# Altium project SC944D.PrjPCB (part 2 of 4)

## Sheet SDEC944-xD_Chargeur_Batterie.SchDoc: Chargeur Batterie
size 393 x 270 mm; CompanyName: Seccom; Address1: 521, rue du capt. François Garbit; Address2: 69440 Mornant; Address3: seccom@seccom.fr; Address4: www.seccom.fr; DocumentNumber: 4; SheetNumber: 4; SheetTotal: 22; PageSetup: Record=PageOptions|CenterHorizontal=True|CenterVertical=True|PrintScale=0.72|XCorrection=1.00|YCorrection=1.00|PrintKind=0|BorderSize=5000000|LeftOffset=0|BottomOffset=0|Orientation=2|PaperLength=1000|PaperWidth=1000|Scale=100|PaperSource=7|PrintQuality=-4|MediaType=1|DitherType=10|PaperKind=A4|PrintScaleMode=1
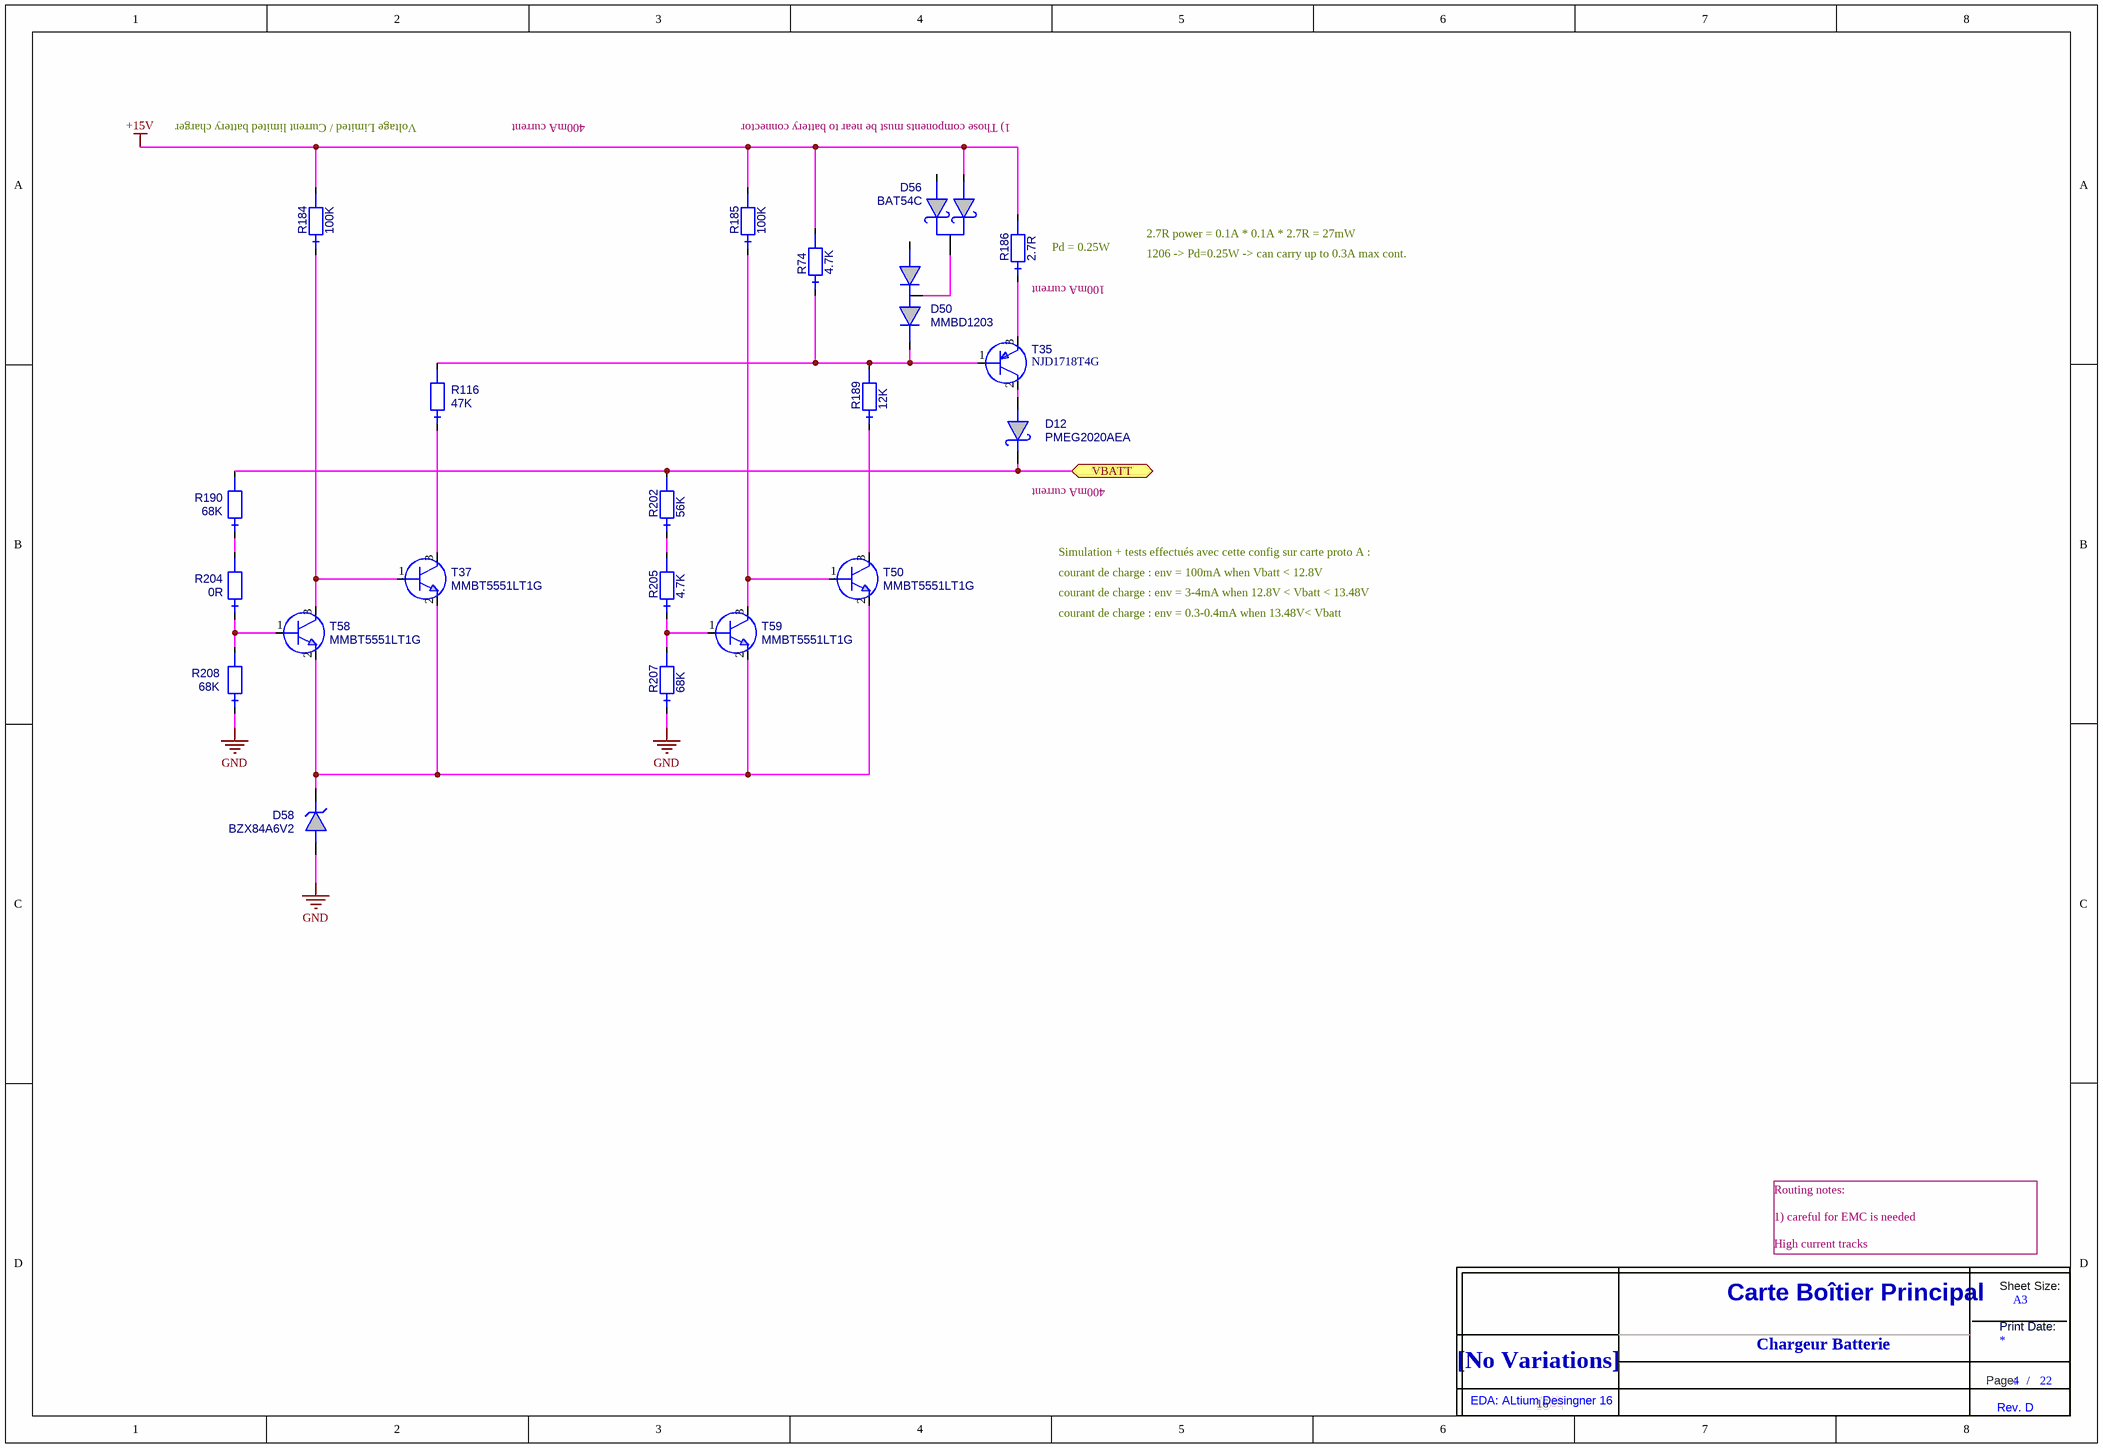
[diagram p3: SDEC944-xD_Chargeur_Batterie.SchDoc]

### Parts
(Parts that share a designator on the sheet are numbered #1, #2 ... from top to bottom, then left to right.)
D12  PMEG2020AEA  [SOD323_ReflowSoldering]
D50  MMBD1203  [SOT23_3L_ReflowSoldering]
D56  BAT54C  [SOT23_3L_ReflowSoldering]
D58  BZX84A6V2  [SOT23_3L_ReflowSoldering]
R74  value 4.7K  [0603_ReflowSoldering_RES]  (hidden comment: RES_0603_1%_100PPM_4.7K)
R116  value 47K  [0603_ReflowSoldering_RES]  (hidden comment: RES_0603_1%_100PPM_47K)
R184  value 100K  [0603_ReflowSoldering_RES]  (hidden comment: RES_0603_1%_100PPM_100K)
R185  value 100K  [0603_ReflowSoldering_RES]  (hidden comment: RES_0603_1%_100PPM_100K)
R186  value 2.7R  [1206_ReflowSoldering_RES]  (hidden comment: RES_1206_1%_100PPM_2.7R)
R189  value 12K  [0603_ReflowSoldering_RES]  (hidden comment: RES_0603_1%_100PPM_12K)
R190  value 68K  [0603_ReflowSoldering_RES]  (hidden comment: RES_0603_1%_100PPM_68K)
R202  value 56K  [0603_ReflowSoldering_RES]  (hidden comment: RES_0603_1%_100PPM_56K)
R204  value 0R  [0603_ReflowSoldering_RES]  (hidden comment: RES_0603_1%_100PPM_0R)
R205  value 4.7K  [0603_ReflowSoldering_RES]  (hidden comment: RES_0603_1%_100PPM_4.7K)
R207  value 68K  [0603_ReflowSoldering_RES]  (hidden comment: RES_0603_1%_100PPM_68K)
R208  value 68K  [0603_ReflowSoldering_RES]  (hidden comment: RES_0603_1%_100PPM_68K)
T35  NJD1718T4G  [DPAK_Specifique_1]
T37  MMBT5551LT1G  [SOT23_3L_ReflowSoldering]
T50  MMBT5551LT1G  [SOT23_3L_ReflowSoldering]
T58  MMBT5551LT1G  [SOT23_3L_ReflowSoldering]
T59  MMBT5551LT1G  [SOT23_3L_ReflowSoldering]
Title_new#4  DNI  (value not drawn)  (graphical)

### Ports
VBATT (bidir)

### Nets
+15V: D56.1 R74.2 R184.2 R185.2 R186.2
GND: D58.1 R207.1 R208.1
VBATT: D12.K R190.2 R202.2 ; port VBATT
NetD12_A: D12.A T35.2(C)
NetD50_2: D50.2 R74.1 R116.2 R189.2 T35.1(B)
NetD50_3: D50.3 D56.3
NetD58_3: D58.3 T37.2(E) T50.2(E) T58.2(E) T59.2(E)
NetR116_1: R116.1 T37.3(C)
NetR184_1: R184.1 T37.1(B) T58.3(C)
NetR185_1: R185.1 T50.1(B) T59.3(C)
NetR186_1: R186.1 T35.3(E)
NetR189_1: R189.1 T50.3(C)
NetR190_1: R190.1 R204.2
NetR202_1: R202.1 R205.2
NetR204_1: R204.1 R208.2 T58.1(B)
NetR205_1: R205.1 R207.2 T59.1(B)

Not connected (* = marked no-connect by the designer): D50 1; D56 2; D58 2

### Notes on the sheet
- Voltage Limited / Current limited battery charger
- 400mA current
- 1) Those components must be near to battery connector
- (near R186) Pd = 0.25W
- 2.7R power = 0.1A * 0.1A * 2.7R = 27mW
- 1206 -> Pd=0.25W -> can carry up to 0.3A max cont.
- (near R186) 100mA current
- (near D12) 400mA current
- courant de charge : env = 100mA when Vbatt < 12.8V
- courant de charge : env = 3-4mA when 12.8V < Vbatt < 13.48V
- Simulation + tests effectués avec cette config sur carte proto A :
- courant de charge : env = 0.3-0.4mA when 13.48V< Vbatt
- Routing notes:
  1) careful for EMC is needed
  High current tracks
- Chargeur Batterie
- 16
- (in symbol Title_new) Sheet Size:; Carte Boîtier Principal; A3; Print Date:; [No Variations]; Page:; /; EDA: ALtium Desingner 16; Rev. D

### Library data of the parts
D12 = PMEG2020AEA: Diode Schottky, Vrrm=20V, If=2A, Vf=0.45V, CMS; Creation: PDP (10/07/12); Boitier: SOD323; Remarque: {Remarque}; Coeff: 1; Fabricant: NXP; Verification: *; ComponentLink1URL: o:\_Documentation\Datasheets\NXP\PMEG2020AEA.PDF; ComponentLink2URL: o:\_Documentation\Datasheets\_BOITIERS\ACTIF_CMS\SOD\SOD_80_(MLL34)_(Schneider).PDF; Config: *; ComponentLink1Description: Datasheet; ComponentLink2Description: Datasheet Boitier; Ref Fab: PMEG2020AEA; Value: PMEG2020AEA
D50 = MMBD1203: Diode de Redressement double, en série, Vrrm=100V, If=200mA, Vf=1V, rapide (trr=4ns), CMS; Creation: LJ (28/04/11); Reference: 001730/00; Boitier: SOT23_3L; Remarque: {Remarque}; Coeff: 1; Fabricant: Fairchild; ComponentLink1URL: o:\_Documentation\Datasheets\Fairchild\MMBD1201-2-3-4-5.pdf; ComponentLink2URL: o:\_Documentation\Datasheets\_BOITIERS\ACTIF_CMS\SOT\SOT_23_3P_(Schneider).PDF; Config: *; ComponentLink1Description: Datasheet; ComponentLink2Description: Datasheet Boitier; Supplier 1: Farnell; Supplier 2: Mouser; Supplier Part Number 1: 1700901; Supplier Part Number 2: 512-MMBD1203; Ref Fab: MMBD1203; Value: MMBD1203
D56 = BAT54C: Diode Schottky double, BAT54 cathode com, Vrrm=30V, If=300mA, Vf=0.4Vmax, CMS; Creation: LJ (14/05/02); Reference: 000597/00; Boitier: SOT23_3L; Remarque: {Remarque}; Coeff: 1; Fabricant: NXP; Verification: LJ (14/05/02); ComponentLink1URL: O:\_Documentation\Datasheets\NXP\BAT54_series.pdf; ComponentLink2URL: o:\_Documentation\Datasheets\_BOITIERS\ACTIF_CMS\SOT\SOT_23_3P_(Schneider).PDF; Config: *; ComponentLink1Description: Datasheet; ComponentLink2Description: Datasheet Boitier; Ref Fab: BAT54C; Supplier 1: Farnell; Supplier Part Number 1: 1081192; Value: BAT54C
D58 = BZX84A6V2: Diode Zener, série BZX84A, 0.3W, +/-5%, 6.2V, CMS; Creation: PDP (19/09/12); Boitier: SOT23_3L; Remarque: {Remarque}; Coeff: 1; Fabricant: NXP; ComponentLink1URL: o:\_Documentation\Datasheets\NXP\BZX84_SERIES.pdf; ComponentLink2URL: o:\_Documentation\Datasheets\_BOITIERS\ACTIF_CMS\SOT\SOT_23_3P_(Schneider).PDF; Config: *; ComponentLink1Description: Datasheet; ComponentLink2Description: Datasheet Boitier; Ref Fab: BZX84A6V2; Supplier 1: Mouser; Supplier Part Number 1: 771-BZX84-A6V2,215; Value: BZX84A6V2
R74 R205 = RES_0603_1%_100PPM_4.7K: Résistance, 0.100W, 1%, 100ppm, 75V, 4.7K; Creation: JPL (05/07/12); Boitier: 0603; Remarque: {Remarque}; Fabricant: Vishay; Ref Fab: CRCW06034K70FKEA; Coeff: 1; Verification: *; ComponentLink1URL: O:\_Documentation\Datasheets\Vishay\Resistances_D-CRCWe3.pdf; ComponentLink2URL: o:\_Documentation\Datasheets\_BOITIERS\PASSIF_CMS\; Config: *; ComponentLink1Description: Datasheet; ComponentLink2Description: Datasheet Boitier; Supplier 1: Farnell; Supplier 2: RadioSpares; Supplier Part Number 1: 1469807; Supplier Part Number 2: 6790484
R116 = RES_0603_1%_100PPM_47K: Résistance, 0.100W, 1%, 100ppm, 75V, 47K; Creation: JPL (05/07/12); Boitier: 0603; Remarque: {Remarque}; Fabricant: Vishay; Ref Fab: CRCW060347K0FKEA; Coeff: 1; Verification: *; ComponentLink1URL: O:\_Documentation\Datasheets\Vishay\Resistances_D-CRCWe3.pdf; ComponentLink2URL: o:\_Documentation\Datasheets\_BOITIERS\PASSIF_CMS\; Config: *; ComponentLink1Description: Datasheet; ComponentLink2Description: Datasheet Boitier; Supplier 1: Farnell; Supplier 2: RadioSpares; Supplier Part Number 1: 1469811; Supplier Part Number 2: 6790425
R184 R185 = RES_0603_1%_100PPM_100K: Résistance, 0.100W, 1%, 100ppm, 75V, 100K; Creation: FB (02/10/12); Boitier: 0603; Remarque: {Remarque}; Fabricant: Vishay; Ref Fab: CRCW0603100KFKEA; Coeff: 1; Verification: *; ComponentLink1URL: O:\_Documentation\Datasheets\Vishay\Resistances_D-CRCWe3.pdf; ComponentLink2URL: o:\_Documentation\Datasheets\_BOITIERS\PASSIF_CMS\; Config: *; ComponentLink1Description: Datasheet; ComponentLink2Description: Datasheet Boitier; Supplier 1: Farnell; Supplier Part Number 1: 1469649; Supplier 2: Mouser; Supplier Part Number 2: 71-CRCW0603-100K-E3
R186 = RES_1206_1%_100PPM_2.7R: Résistance, 0.25W, 1%, 100ppm, 200V, 2.7R; Creation: FB (02/10/12); Boitier: 1206; Remarque: {Remarque}; Fabricant: Vishay; Ref Fab: CRCW12062R70FKEA; Coeff: 1; Verification: *; ComponentLink1URL: O:\_Documentation\Datasheets\Vishay\Resistances_D-CRCWe3.pdf; ComponentLink2URL: o:\_Documentation\Datasheets\_BOITIERS\PASSIF_CMS\; Config: *; ComponentLink1Description: Datasheet; ComponentLink2Description: Datasheet Boitier
R189 = RES_0603_1%_100PPM_12K: Résistance, 0.100W, 1%, 100ppm, 75V, 12K; Creation: PDP (19/09/12); Boitier: 0603; Remarque: {Remarque}; Fabricant: Vishay; Ref Fab: CRCW060312K0FKEA; Coeff: 1; ComponentLink1URL: O:\_Documentation\Datasheets\Vishay\Resistances_D-CRCWe3.pdf; ComponentLink2URL: o:\_Documentation\Datasheets\_BOITIERS\PASSIF_CMS\; Config: *; ComponentLink1Description: Datasheet; ComponentLink2Description: Datasheet Boitier; Supplier 1: Mouser; Supplier Part Number 1: 71-CRCW0603-12K-E3; Supplier 2: Farnell; Supplier Part Number 2: 1652834
R190 R207 R208 = RES_0603_1%_100PPM_68K: Résistance, 0.100W, 1%, 100ppm, 75V, 68K; Creation: PDP (19/09/12); Boitier: 0603; Remarque: {Remarque}; Fabricant: Vishay; Ref Fab: CRCW060368K0FKEA; Coeff: 1; Verification: *; ComponentLink1URL: O:\_Documentation\Datasheets\Vishay\Resistances_D-CRCWe3.pdf; ComponentLink2URL: o:\_Documentation\Datasheets\_BOITIERS\PASSIF_CMS\; Config: *; ComponentLink1Description: Datasheet; ComponentLink2Description: Datasheet Boitier; Supplier 1: Mouser; Supplier Part Number 1: 71-CRCW0603-68K-E3; Supplier 2: Farnell; Supplier Part Number 2: 1469832RL
R202 = RES_0603_1%_100PPM_56K: Résistance, 0.100W, 1%, 100ppm, 75V, 56K; Creation: PDP 19/09/2012; Boitier: 0603; Remarque: {Remarque}; Fabricant: Vishay; Ref Fab: CRCW060356K0FKEA; Coeff: 1; ComponentLink1URL: O:\_Documentation\Datasheets\Vishay\Resistances_D-CRCWe3.pdf; ComponentLink2URL: o:\_Documentation\Datasheets\_BOITIERS\PASSIF_CMS\; Config: *; ComponentLink1Description: Datasheet; ComponentLink2Description: Datasheet Boitier; Supplier 1: Farnell; Supplier Part Number 1: 1613127; Supplier 2: Mouser; Supplier Part Number 2: 71-CRCW0603-56K-E3
R204 = RES_0603_1%_100PPM_0R: Résistance, 0.100W, 1%, 100ppm, 75V, 0R; Creation: FB (04/07/12); Boitier: 0603; Remarque: {Remarque}; Fabricant: Vishay; Ref Fab: CRCW06030000Z0EA; Coeff: 1; Verification: *; ComponentLink1URL: O:\_Documentation\Datasheets\Vishay\Resistances_D-CRCWe3.pdf; ComponentLink2URL: o:\_Documentation\Datasheets\_BOITIERS\PASSIF_CMS\; Config: *; ComponentLink1Description: Datasheet; ComponentLink2Description: Datasheet Boitier; Supplier 1: Farnell; Supplier Part Number 1: 1469739
T35 = NJD1718T4G: Transistor PNP, Vce=50V, Ic=3A, 15W, hfe=40~240, -65/+150°C, CMS; Creation: PDP (19/09/12); Boitier: DPAK; Remarque: {Remarque}; Coeff: 1; Fabricant: ON Semiconductor; ComponentLink1URL: o:\_Documentation\Datasheets\ON_Semiconductors\NJD1718-D.PDF; Config: *; ComponentLink1Description: Datasheet; ComponentLink2Description: Datasheet Boitier; Supplier 1: Mouser; Supplier Part Number 1: 863-NJD1718T4G; Ref Fab: NJD1718T4G; Value: NJD1718T4G
T37 T50 T58 T59 = MMBT5551LT1G: Transistor NPN, Vce=160V, Ic=60mA, 0.225W, hfe=30~250, -55/+150°C, CMS; Creation: CHD; Reference: 000474/00; Boitier: SOT23_3L; Remarque: {Remarque}; Coeff: 1; Fabricant: ON Semiconductor; Verification: *; ComponentLink1URL: o:\_Documentation\Datasheets\ON_Semiconductors\MMBT5550LT1.pdf; ComponentLink2URL: O:\_Documentation\Datasheets\_BOITIERS\ACTIF_CMS\SOT & TSOT\SOT23_3_(Schneider).pdf; Config: *; ComponentLink1Description: Datasheet; Supplier 1: Farnell; Supplier 2: Mouser; Ref Fab: MMBT5551LT1G; Value: MMBT5551LT1G; Supplier Part Number 1: 1459109; Supplier Part Number 2: 863-MMBT5551LT1G; ComponentLink2Description: Datasheet Boitier
Title_new#4 = Title_new

## Sheet SDEC944-xD_Coeur.SchDoc: Coeur
size 393 x 270 mm; CompanyName: Seccom; Address1: 521, rue du capt. François Garbit; Address2: 69440 Mornant; Address3: seccom@seccom.fr; Address4: www.seccom.fr; DocumentNumber: 5; SheetNumber: 5; SheetTotal: 22; PageSetup: Record=PageOptions|CenterHorizontal=True|CenterVertical=True|PrintScale=0.74|XCorrection=1.00|YCorrection=1.00|PrintKind=0|BorderSize=5000000|LeftOffset=0|BottomOffset=0|Orientation=2|PaperLength=1000|PaperWidth=1000|Scale=100|PaperSource=7|PrintQuality=-4|MediaType=1|DitherType=10|PaperKind=A4|PrintScaleMode=1
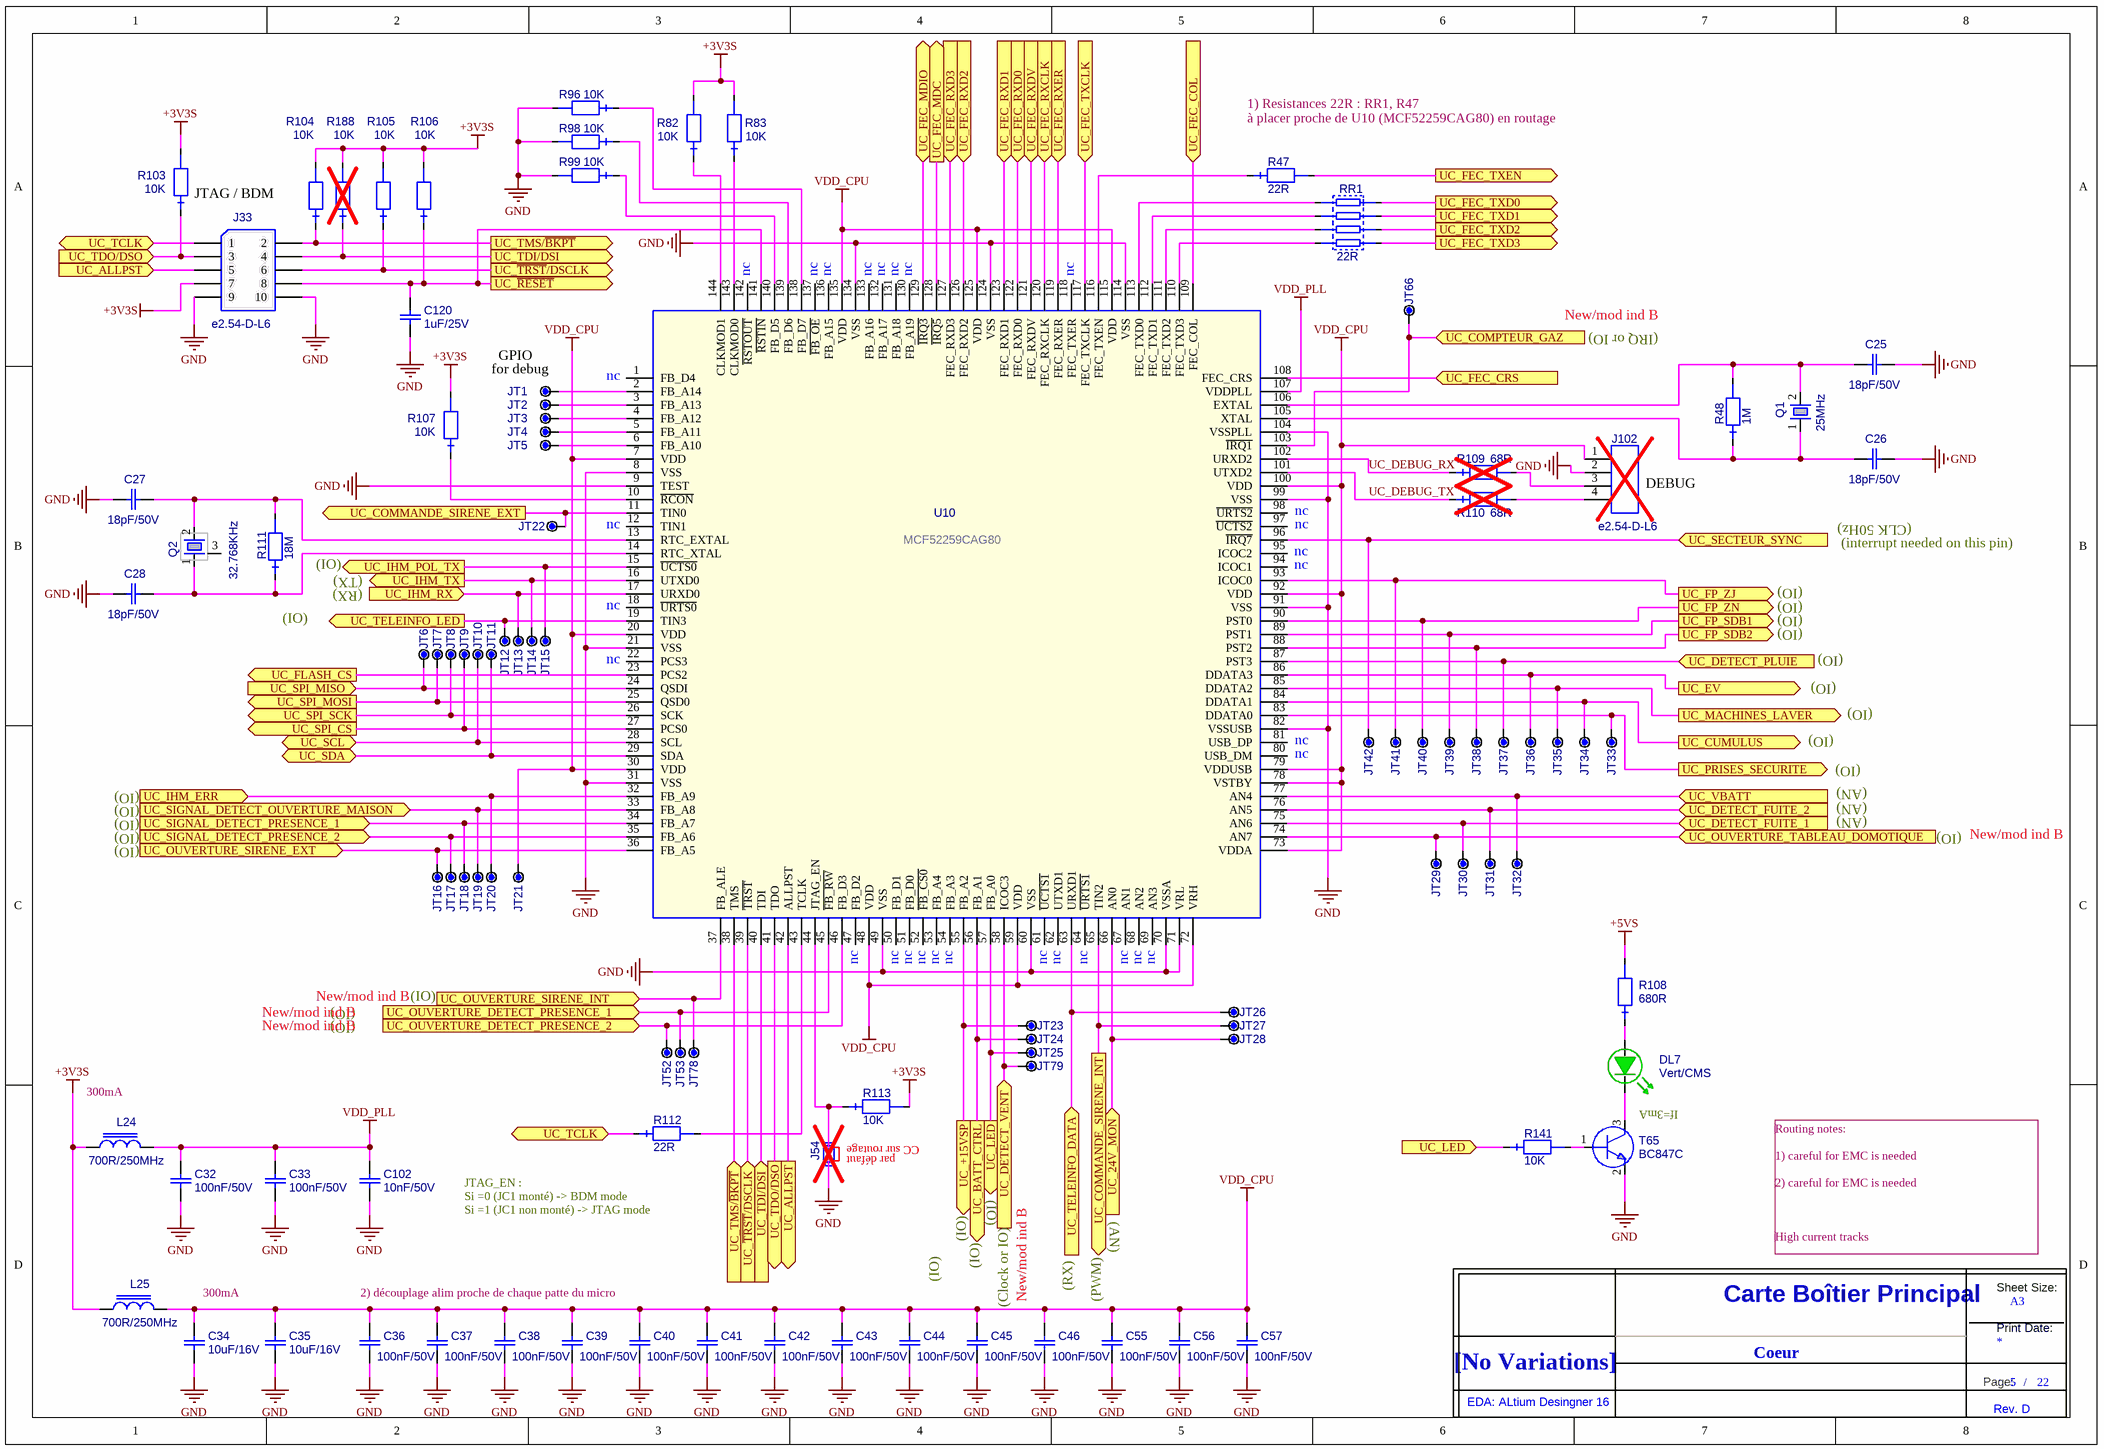
[diagram p4: SDEC944-xD_Coeur.SchDoc]

### Parts
(Parts that share a designator on the sheet are numbered #1, #2 ... from top to bottom, then left to right.)
C25  value 18pF/50V  [0603_ReflowSoldering_CAP]  (hidden comment: C_0603_NPO_5%_18P-50V)
C26  value 18pF/50V  [0603_ReflowSoldering_CAP]  (hidden comment: C_0603_NPO_5%_18P-50V)
C27  value 18pF/50V  [0603_ReflowSoldering_CAP]  (hidden comment: C_0603_NPO_5%_18P-50V)
C28  value 18pF/50V  [0603_ReflowSoldering_CAP]  (hidden comment: C_0603_NPO_5%_18P-50V)
C32  value 100nF/50V  [0603_ReflowSoldering_CAP]  (hidden comment: C_0603_X7R_10%_100N-50V)
C33  value 100nF/50V  [0603_ReflowSoldering_CAP]  (hidden comment: C_0603_X7R_10%_100N-50V)
C34  value 10uF/16V  [0805_ReflowSoldering_CAP]  (hidden comment: C_0805_X5R_10%_10U-16V)
C35  value 10uF/16V  [0805_ReflowSoldering_CAP]  (hidden comment: C_0805_X5R_10%_10U-16V)
C36  value 100nF/50V  [0603_ReflowSoldering_CAP]  (hidden comment: C_0603_X7R_10%_100N-50V)
C37  value 100nF/50V  [0603_ReflowSoldering_CAP]  (hidden comment: C_0603_X7R_10%_100N-50V)
C38  value 100nF/50V  [0603_ReflowSoldering_CAP]  (hidden comment: C_0603_X7R_10%_100N-50V)
C39  value 100nF/50V  [0603_ReflowSoldering_CAP]  (hidden comment: C_0603_X7R_10%_100N-50V)
C40  value 100nF/50V  [0603_ReflowSoldering_CAP]  (hidden comment: C_0603_X7R_10%_100N-50V)
C41  value 100nF/50V  [0603_ReflowSoldering_CAP]  (hidden comment: C_0603_X7R_10%_100N-50V)
C42  value 100nF/50V  [0603_ReflowSoldering_CAP]  (hidden comment: C_0603_X7R_10%_100N-50V)
C43  value 100nF/50V  [0603_ReflowSoldering_CAP]  (hidden comment: C_0603_X7R_10%_100N-50V)
C44  value 100nF/50V  [0603_ReflowSoldering_CAP]  (hidden comment: C_0603_X7R_10%_100N-50V)
C45  value 100nF/50V  [0603_ReflowSoldering_CAP]  (hidden comment: C_0603_X7R_10%_100N-50V)
C46  value 100nF/50V  [0603_ReflowSoldering_CAP]  (hidden comment: C_0603_X7R_10%_100N-50V)
C55  value 100nF/50V  [0603_ReflowSoldering_CAP]  (hidden comment: C_0603_X7R_10%_100N-50V)
C56  value 100nF/50V  [0603_ReflowSoldering_CAP]  (hidden comment: C_0603_X7R_10%_100N-50V)
C57  value 100nF/50V  [0603_ReflowSoldering_CAP]  (hidden comment: C_0603_X7R_10%_100N-50V)
C102  value 10nF/50V  [0603_ReflowSoldering_CAP]  (hidden comment: C_0603_X7R_10%_10N-50V)
C120  value 1uF/25V  [0805_ReflowSoldering_CAP]  (hidden comment: C_0805_X5R_10%_1U-25V)
DL7  value Vert/CMS  [LED_0805_KPx_Green]  (hidden comment: LED_0805_VERT_KP2012)
J33  value e2.54-D-L6  [BAR_M_2X05D_L6_IS2.6_E2.54_G]  (hidden comment: BARRETTE_2.54_M_D_2X05_L6_G)
J54  CAVALIER_EMBASE_2PTS_E2.54  [BAR_M_1X02D_L6_IS2.6_E2.54_G]  (value not drawn)  (no BOM)
J102  value e2.54-D-L6  [BAR_M_1X04D_L6_IS2.6_E2.54_G]  (hidden comment: BARRETTE_2.54_M_D_1X04_L6_G)  (no BOM)
JT1  POINT_TEST_PAD_40MIL  [PAD_CL5_E40X40Y17D]  (value not drawn)  (no BOM)
JT2  POINT_TEST_PAD_40MIL  [PAD_CL5_E40X40Y17D]  (value not drawn)  (no BOM)
JT3  POINT_TEST_PAD_40MIL  [PAD_CL5_E40X40Y17D]  (value not drawn)  (no BOM)
JT4  POINT_TEST_PAD_40MIL  [PAD_CL5_E40X40Y17D]  (value not drawn)  (no BOM)
JT5  POINT_TEST_PAD_40MIL  [PAD_CL5_E40X40Y17D]  (value not drawn)  (no BOM)
JT6  POINT_TEST_PAD_40MIL  [PAD_CL5_E40X40Y17D]  (value not drawn)  (no BOM)
JT7  POINT_TEST_PAD_40MIL  [PAD_CL5_E40X40Y17D]  (value not drawn)  (no BOM)
JT8  POINT_TEST_PAD_40MIL  [PAD_CL5_E40X40Y17D]  (value not drawn)  (no BOM)
JT9  POINT_TEST_PAD_40MIL  [PAD_CL5_E40X40Y17D]  (value not drawn)  (no BOM)
JT10  POINT_TEST_PAD_40MIL  [PAD_CL5_E40X40Y17D]  (value not drawn)  (no BOM)
JT11  POINT_TEST_PAD_40MIL  [PAD_CL5_E40X40Y17D]  (value not drawn)  (no BOM)
JT12  POINT_TEST_PAD_40MIL  [PAD_CL5_E40X40Y17D]  (value not drawn)  (no BOM)
JT13  POINT_TEST_PAD_40MIL  [PAD_CL5_E40X40Y17D]  (value not drawn)  (no BOM)
JT14  POINT_TEST_PAD_40MIL  [PAD_CL5_E40X40Y17D]  (value not drawn)  (no BOM)
JT15  POINT_TEST_PAD_40MIL  [PAD_CL5_E40X40Y17D]  (value not drawn)  (no BOM)
JT16  POINT_TEST_PAD_40MIL  [PAD_CL5_E40X40Y17D]  (value not drawn)  (no BOM)
JT17  POINT_TEST_PAD_40MIL  [PAD_CL5_E40X40Y17D]  (value not drawn)  (no BOM)
JT18  POINT_TEST_PAD_40MIL  [PAD_CL5_E40X40Y17D]  (value not drawn)  (no BOM)
JT19  POINT_TEST_PAD_40MIL  [PAD_CL5_E40X40Y17D]  (value not drawn)  (no BOM)
JT20  POINT_TEST_PAD_40MIL  [PAD_CL5_E40X40Y17D]  (value not drawn)  (no BOM)
JT21  POINT_TEST_PAD_40MIL  [PAD_CL5_E40X40Y17D]  (value not drawn)  (no BOM)
JT22  POINT_TEST_PAD_40MIL  [PAD_CL5_E40X40Y17D]  (value not drawn)  (no BOM)
JT23  POINT_TEST_PAD_40MIL  [PAD_CL5_E40X40Y17D]  (value not drawn)  (no BOM)
JT24  POINT_TEST_PAD_40MIL  [PAD_CL5_E40X40Y17D]  (value not drawn)  (no BOM)
JT25  POINT_TEST_PAD_40MIL  [PAD_CL5_E40X40Y17D]  (value not drawn)  (no BOM)
JT26  POINT_TEST_PAD_40MIL  [PAD_CL5_E40X40Y17D]  (value not drawn)  (no BOM)
JT27  POINT_TEST_PAD_40MIL  [PAD_CL5_E40X40Y17D]  (value not drawn)  (no BOM)
JT28  POINT_TEST_PAD_40MIL  [PAD_CL5_E40X40Y17D]  (value not drawn)  (no BOM)
JT29  POINT_TEST_PAD_40MIL  [PAD_CL5_E40X40Y17D]  (value not drawn)  (no BOM)
JT30  POINT_TEST_PAD_40MIL  [PAD_CL5_E40X40Y17D]  (value not drawn)  (no BOM)
JT31  POINT_TEST_PAD_40MIL  [PAD_CL5_E40X40Y17D]  (value not drawn)  (no BOM)
JT32  POINT_TEST_PAD_40MIL  [PAD_CL5_E40X40Y17D]  (value not drawn)  (no BOM)
JT33  POINT_TEST_PAD_40MIL  [PAD_CL5_E40X40Y17D]  (value not drawn)  (no BOM)
JT34  POINT_TEST_PAD_40MIL  [PAD_CL5_E40X40Y17D]  (value not drawn)  (no BOM)
JT35  POINT_TEST_PAD_40MIL  [PAD_CL5_E40X40Y17D]  (value not drawn)  (no BOM)
JT36  POINT_TEST_PAD_40MIL  [PAD_CL5_E40X40Y17D]  (value not drawn)  (no BOM)
JT37  POINT_TEST_PAD_40MIL  [PAD_CL5_E40X40Y17D]  (value not drawn)  (no BOM)
JT38  POINT_TEST_PAD_40MIL  [PAD_CL5_E40X40Y17D]  (value not drawn)  (no BOM)
JT39  POINT_TEST_PAD_40MIL  [PAD_CL5_E40X40Y17D]  (value not drawn)  (no BOM)
JT40  POINT_TEST_PAD_40MIL  [PAD_CL5_E40X40Y17D]  (value not drawn)  (no BOM)
JT41  POINT_TEST_PAD_40MIL  [PAD_CL5_E40X40Y17D]  (value not drawn)  (no BOM)
JT42  POINT_TEST_PAD_40MIL  [PAD_CL5_E40X40Y17D]  (value not drawn)  (no BOM)
JT52  POINT_TEST_PAD_40MIL  [PAD_CL5_E40X40Y17D]  (value not drawn)  (no BOM)
JT53  POINT_TEST_PAD_40MIL  [PAD_CL5_E40X40Y17D]  (value not drawn)  (no BOM)
JT66  POINT_TEST_PAD_40MIL  [PAD_CL5_E40X40Y17D]  (value not drawn)  (no BOM)
JT78  POINT_TEST_PAD_40MIL  [PAD_CL5_E40X40Y17D]  (value not drawn)  (no BOM)
JT79  POINT_TEST_PAD_40MIL  [PAD_CL5_E40X40Y17D]  (value not drawn)  (no BOM)
L24  value 700R/250MHz  [0603_ReflowSoldering_CAP]  (hidden comment: IND_FERRITE_0603_742792643)
L25  value 700R/250MHz  [0603_ReflowSoldering_CAP]  (hidden comment: IND_FERRITE_0603_742792643)
Q1  value 25MHz  [QUARTZ_HC49_11.5X5_CMS]  (hidden comment: QUARTZ_HC49/4HSMX_25M)
Q2  value 32.768KHz  [QUARTZ_2X6MM_CYL_CMS]  (hidden comment: QUARTZ_2X6MM_CMS_32.768KHZ)
R47  value 22R  [0603_ReflowSoldering_RES]  (hidden comment: RES_0603_1%_100PPM_22R)
R48  value 1M  [0603_ReflowSoldering_RES]  (hidden comment: RES_0603_1%_100PPM_1M)
R82  value 10K  [0603_ReflowSoldering_RES]  (hidden comment: RES_0603_1%_100PPM_10K)
R83  value 10K  [0603_ReflowSoldering_RES]  (hidden comment: RES_0603_1%_100PPM_10K)
R96  value 10K  [0603_ReflowSoldering_RES]  (hidden comment: RES_0603_1%_100PPM_10K)
R98  value 10K  [0603_ReflowSoldering_RES]  (hidden comment: RES_0603_1%_100PPM_10K)
R99  value 10K  [0603_ReflowSoldering_RES]  (hidden comment: RES_0603_1%_100PPM_10K)
R103  value 10K  [0603_ReflowSoldering_RES]  (hidden comment: RES_0603_1%_100PPM_10K)
R104  value 10K  [0603_ReflowSoldering_RES]  (hidden comment: RES_0603_1%_100PPM_10K)
R105  value 10K  [0603_ReflowSoldering_RES]  (hidden comment: RES_0603_1%_100PPM_10K)
R106  value 10K  [0603_ReflowSoldering_RES]  (hidden comment: RES_0603_1%_100PPM_10K)
R107  value 10K  [0603_ReflowSoldering_RES]  (hidden comment: RES_0603_1%_100PPM_10K)
R108  value 680R  [0603_ReflowSoldering_RES]  (hidden comment: RES_0603_1%_100PPM_680R)
R109  value 68R  [0603_ReflowSoldering_RES]  (hidden comment: RES_0603_1%_100PPM_68R)  (no BOM)
R110  value 68R  [0603_ReflowSoldering_RES]  (hidden comment: RES_0603_1%_100PPM_68R)  (no BOM)
R111  value 18M  [0805_ReflowSoldering_RES]  (hidden comment: RES_0805_5%_300PPM_18M)
R112  value 22R  [0603_ReflowSoldering_RES]  (hidden comment: RES_0603_1%_100PPM_22R)
R113  value 10K  [0603_ReflowSoldering_RES]  (hidden comment: RES_0603_1%_100PPM_10K)
R141  value 10K  [0603_ReflowSoldering_RES]  (hidden comment: RES_0603_1%_100PPM_10K)
R188  value 10K  [0603_ReflowSoldering_RES]  (hidden comment: RES_0603_1%_100PPM_10K)  (no BOM)
RR1  value 22R  [ARV241]  (hidden comment: RES_4XR0603_IND_5%_22R*)
T65  BC847C  [SOT23_3L_ReflowSoldering]
Title_new#5  DNI  (value not drawn)  (graphical)
U10  MCF52259CAG80  [QFP_144_E0,50_20X20MM]

### Ports
UC_24V_MON (in), UC_+15VSP (out), UC_ALLPST (in), UC_ALLPST (out), UC_BATT_CTRL (out), UC_COMMANDE_SIRENE_EXT (out), UC_COMMANDE_SIRENE_INT (out), UC_COMPTEUR_GAZ (in), UC_CUMULUS (out), UC_DETECT_FUITE_1 (in), UC_DETECT_FUITE_2 (in), UC_DETECT_PLUIE (in), UC_DETECT_VENT (in), UC_EV (out), UC_FEC_COL (in), UC_FEC_CRS (in), UC_FEC_MDC (out), UC_FEC_MDIO (bidir), UC_FEC_RXCLK (in), UC_FEC_RXD0 (in), UC_FEC_RXD1 (in), UC_FEC_RXD2 (in), UC_FEC_RXD3 (in), UC_FEC_RXDV (in), UC_FEC_RXER (in), UC_FEC_TXCLK (in), UC_FEC_TXD0 (out), UC_FEC_TXD1 (out), UC_FEC_TXD2 (out), UC_FEC_TXD3 (out), UC_FEC_TXEN (out), UC_FLASH_CS (out), UC_FP_SDB1 (out), UC_FP_SDB2 (out), UC_FP_ZJ (out), UC_FP_ZN (out), UC_IHM_ERR (in), UC_IHM_POL_TX (out), UC_IHM_RX (in), UC_IHM_TX (out), UC_LED (in), UC_LED (out), UC_MACHINES_LAVER (out), UC_OUVERTURE_DETECT_PRESENCE_1 (in), UC_OUVERTURE_DETECT_PRESENCE_2 (in), UC_OUVERTURE_SIRENE_EXT (in), UC_OUVERTURE_SIRENE_INT (in), UC_OUVERTURE_TABLEAU_DOMOTIQUE (in), UC_PRISES_SECURITE (out), UC_SCL, UC_SDA, UC_SECTEUR_SYNC (in), UC_SIGNAL_DETECT_OUVERTURE_MAISON (in), UC_SIGNAL_DETECT_PRESENCE_1 (in), UC_SIGNAL_DETECT_PRESENCE_2 (in), UC_SPI_CS (out), UC_SPI_MISO (in), UC_SPI_MOSI (out), UC_SPI_SCK (out), UC_TCLK (bidir), UC_TDI/DSI (in), UC_TDI/DSI (out), UC_TDO/DSO (in), UC_TDO/DSO (out), UC_TELEINFO_DATA (in), UC_TELEINFO_LED (out), UC_TMS/~{BKPT} (in), UC_TMS/~{BKPT} (out), UC_VBATT (in), UC_~{RESET} (out), UC_~{TRST}/DSCLK (in), UC_~{TRST}/DSCLK (out)

### Nets
+3V3S: J33.7 L24.1 L25.1 R82.2 R83.2 R103.2 R104.2 R105.2 R106.2 R107.2 R113.2 R188.2
+5VS: R108.2
GND: C25.1 C26.1 C27.2 C28.2 C32.2 C33.2 C34.1 C35.1 C36.2 C37.2 C38.2 C39.2 C40.2 C41.2 C42.2 C43.2 C44.2 C45.2 C46.2 C55.2 C56.2 C57.2 C102.1 C120.1 J33.9 J33.10 J54.1 J102.2 R96.2 R98.2 R99.2 T65.2(E) U10.8(VSS) U10.9(TEST) U10.21(VSS) U10.31(VSS) U10.49(VSS) U10.60(VSS) U10.70(VSSA) U10.71(VRL) U10.82(VSSUSB) U10.91(VSS) U10.99(VSS) U10.104(VSSPLL) U10.114(VSS) U10.124(VSS) U10.134(VSS)
VDD_CPU: C34.2 C35.2 C36.1 C37.1 C38.1 C39.1 C40.1 C41.1 C42.1 C43.1 C44.1 C45.1 C46.1 C55.1 C56.1 C57.1 J102.1 JT21.1 L25.2 U10.7(VDD) U10.20(VDD) U10.30(VDD) U10.48(VDD) U10.59(VDD) U10.72(VRH) U10.73(VDDA) U10.78(VSTBY) U10.79(VDDUSB) U10.92(VDD) U10.100(VDD) U10.115(VDD) U10.125(VDD) U10.135(VDD)
VDD_PLL: C32.1 C33.1 C102.2 L24.2 U10.107(VDDPLL)
UC_24V_MON: JT28.1 U10.66(AN0) ; port UC_24V_MON
UC_+15VSP: JT23.1 U10.55(FB_A2) ; port UC_+15VSP
UC_ALLPST: J33.5 U10.42(ALLPST) ; port UC_ALLPST
UC_BATT_CTRL: JT24.1 U10.56(FB_A1) ; port UC_BATT_CTRL
UC_COMMANDE_SIRENE_EXT: JT22.1 U10.11(TIN0) ; port UC_COMMANDE_SIRENE_EXT
UC_COMMANDE_SIRENE_INT: JT27.1 U10.65(TIN2) ; port UC_COMMANDE_SIRENE_INT
UC_COMPTEUR_GAZ: JT66.1 U10.103(~{IRQ1}) ; port UC_COMPTEUR_GAZ
UC_CUMULUS: JT34.1 U10.84(DDATA1) ; port UC_CUMULUS
UC_DEBUG_RX: R109.1 U10.102(URXD2)
UC_DEBUG_TX: R110.1 U10.101(UTXD2)
UC_DETECT_FUITE_1: JT30.1 U10.75(AN6) ; port UC_DETECT_FUITE_1
UC_DETECT_FUITE_2: JT31.1 U10.76(AN5) ; port UC_DETECT_FUITE_2
UC_DETECT_PLUIE: JT37.1 U10.87(PST3) ; port UC_DETECT_PLUIE
UC_DETECT_VENT: JT79.1 U10.58(ICOC3) ; port UC_DETECT_VENT
UC_EV: JT36.1 U10.86(DDATA3) ; port UC_EV
UC_FEC_COL: U10.109(FEC_COL) ; port UC_FEC_COL
UC_FEC_CRS: U10.108(FEC_CRS) ; port UC_FEC_CRS
UC_FEC_MDC: U10.128(~{IRQ5}) ; port UC_FEC_MDC
UC_FEC_MDIO: U10.129(~{IRQ3}) ; port UC_FEC_MDIO
UC_FEC_RXCLK: U10.120(FEC_RXCLK) ; port UC_FEC_RXCLK
UC_FEC_RXD0: U10.122(FEC_RXD0) ; port UC_FEC_RXD0
UC_FEC_RXD1: U10.123(FEC_RXD1) ; port UC_FEC_RXD1
UC_FEC_RXD2: U10.126(FEC_RXD2) ; port UC_FEC_RXD2
UC_FEC_RXD3: U10.127(FEC_RXD3) ; port UC_FEC_RXD3
UC_FEC_RXDV: U10.121(FEC_RXDV) ; port UC_FEC_RXDV
UC_FEC_RXER: U10.119(FEC_RXER) ; port UC_FEC_RXER
UC_FEC_TXCLK: U10.117(FEC_TXCLK) ; port UC_FEC_TXCLK
UC_FEC_TXD0: RR1.1 ; port UC_FEC_TXD0
UC_FEC_TXD1: RR1.3 ; port UC_FEC_TXD1
UC_FEC_TXD2: RR1.5 ; port UC_FEC_TXD2
UC_FEC_TXD3: RR1.7 ; port UC_FEC_TXD3
UC_FEC_TXEN: R47.2 ; port UC_FEC_TXEN
UC_FLASH_CS: U10.23(PCS2) ; port UC_FLASH_CS
UC_FP_SDB1: JT39.1 U10.89(PST1) ; port UC_FP_SDB1
UC_FP_SDB2: JT38.1 U10.88(PST2) ; port UC_FP_SDB2
UC_FP_ZJ: JT41.1 U10.93(ICOC0) ; port UC_FP_ZJ
UC_FP_ZN: JT40.1 U10.90(PST0) ; port UC_FP_ZN
UC_IHM_ERR: JT20.1 U10.32(FB_A9) ; port UC_IHM_ERR
UC_IHM_POL_TX: JT15.1 U10.15(~{UCTS0}) ; port UC_IHM_POL_TX
UC_IHM_RX: JT13.1 U10.17(URXD0) ; port UC_IHM_RX
UC_IHM_TX: JT14.1 U10.16(UTXD0) ; port UC_IHM_TX
UC_LED: JT25.1 R141.1 U10.57(FB_A0) ; port UC_LED
UC_MACHINES_LAVER: JT35.1 U10.85(DDATA2) ; port UC_MACHINES_LAVER
UC_OUVERTURE_DETECT_PRESENCE_1: JT53.1 U10.45(~{FB_RW}) ; port UC_OUVERTURE_DETECT_PRESENCE_1
UC_OUVERTURE_DETECT_PRESENCE_2: JT52.1 U10.46(FB_D3) ; port UC_OUVERTURE_DETECT_PRESENCE_2
UC_OUVERTURE_SIRENE_EXT: JT16.1 U10.36(FB_A5) ; port UC_OUVERTURE_SIRENE_EXT
UC_OUVERTURE_SIRENE_INT: JT78.1 U10.37(FB_ALE) ; port UC_OUVERTURE_SIRENE_INT
UC_OUVERTURE_TABLEAU_DOMOTIQUE: JT29.1 U10.74(AN7) ; port UC_OUVERTURE_TABLEAU_DOMOTIQUE
UC_PRISES_SECURITE: JT33.1 U10.83(DDATA0) ; port UC_PRISES_SECURITE
UC_~{RESET}: C120.2 J33.8 R106.1 U10.141(~{RSTIN}) ; port UC_~{RESET}
UC_SCL: JT10.1 U10.28(SCL) ; port UC_SCL
UC_SDA: JT11.1 U10.29(SDA) ; port UC_SDA
UC_SECTEUR_SYNC: JT42.1 U10.96(~{IRQ7}) ; port UC_SECTEUR_SYNC
UC_SIGNAL_DETECT_OUVERTURE_MAISON: JT19.1 U10.33(FB_A8) ; port UC_SIGNAL_DETECT_OUVERTURE_MAISON
UC_SIGNAL_DETECT_PRESENCE_1: JT18.1 U10.34(FB_A7) ; port UC_SIGNAL_DETECT_PRESENCE_1
UC_SIGNAL_DETECT_PRESENCE_2: JT17.1 U10.35(FB_A6) ; port UC_SIGNAL_DETECT_PRESENCE_2
UC_SPI_CS: JT9.1 U10.27(PCS0) ; port UC_SPI_CS
UC_SPI_MISO: JT6.1 U10.24(QSDI) ; port UC_SPI_MISO
UC_SPI_MOSI: JT7.1 U10.25(QSD0) ; port UC_SPI_MOSI
UC_SPI_SCK: JT8.1 U10.26(SCK) ; port UC_SPI_SCK
UC_~{TRST}/DSCLK: J33.6 R105.1 U10.39(~{TRST}) ; port UC_~{TRST}/DSCLK
UC_TCLK: J33.1 R112.1 ; port UC_TCLK
UC_TDI/DSI: J33.4 R188.1 U10.40(TDI) ; port UC_TDI/DSI
UC_TDO/DSO: J33.3 R103.1 U10.41(TDO) ; port UC_TDO/DSO
UC_TELEINFO_DATA: JT26.1 U10.63(URXD1) ; port UC_TELEINFO_DATA
UC_TELEINFO_LED: JT12.1 U10.19(TIN3) ; port UC_TELEINFO_LED
UC_TMS/~{BKPT}: J33.2 R104.1 U10.38(TMS) ; port UC_TMS/~{BKPT}
UC_VBATT: JT32.1 U10.77(AN4) ; port UC_VBATT
NetC25_2: C25.2 Q1.2 R48.2 U10.106(EXTAL)
NetC26_2: C26.2 Q1.1 R48.1 U10.105(XTAL)
NetC27_1: C27.1 Q2.2 R111.2 U10.13(RTC_EXTAL)
NetC28_1: C28.1 Q2.1 R111.1 U10.14(RTC_XTAL)
NetDL7_A: DL7.A R108.1
NetDL7_K: DL7.K T65.3(C)
NetJ54_2: J54.2 R113.1 U10.44(JTAG_EN)
NetJ102_3: J102.3 R109.2
NetJ102_4: J102.4 R110.2
NetJT1_1: JT1.1 U10.2(FB_A14)
NetJT2_1: JT2.1 U10.3(FB_A13)
NetJT3_1: JT3.1 U10.4(FB_A12)
NetJT4_1: JT4.1 U10.5(FB_A11)
NetJT5_1: JT5.1 U10.6(FB_A10)
NetR47_1: R47.1 U10.116(FEC_TXEN)
NetR82_1: R82.1 U10.144(CLKMOD1)
NetR83_1: R83.1 U10.143(CLKMOD0)
NetR96_1: R96.1 U10.138(FB_D7)
NetR98_1: R98.1 U10.139(FB_D6)
NetR99_1: R99.1 U10.140(FB_D5)
NetR107_1: R107.1 U10.10(~{RCON})
NetR112_2: R112.2 U10.43(TCLK)
NetR141_2: R141.2 T65.1(B)
NetRR1_2: RR1.2 U10.113(FEC_TXD0)
NetRR1_4: RR1.4 U10.112(FEC_TXD1)
NetRR1_6: RR1.6 U10.111(FEC_TXD2)
NetRR1_8: RR1.8 U10.110(FEC_TXD3)

Not connected (* = marked no-connect by the designer): Q2 3; U10 1(FB_D4) 12(TIN1) 18(~{URTS0}) 22(PCS3) 47(FB_D2) 50(FB_D1) 51(FB_D0) 52(~{FB_CS0}) 53(FB_A4) 54(FB_A3) 61(~{UCTS1}) 62(UTXD1) 64(~{URTS1}) 67(AN1) 68(AN2) 69(AN3) 80(USB_DM) 81(USB_DP) 94(ICOC1) 95(ICOC2) 97(~{UCTS2}) 98(~{URTS2}) 118(FEC_TXER) 130(FB_A19) 131(FB_A18) 132(FB_A17) 133(FB_A16) 136(FB_A15) 137(~{FB_OE}) 142(~{RSTOUT})

### Notes on the sheet
- (near R47) 1) Resistances 22R : RR1, R47
  à placer proche de U10 (MCF52259CAG80) en routage
- (near R103) JTAG / BDM
- (near U10) nc
- New/mod ind B
- (near JT1) for debug
- GPIO
- (IRQ or IO)
- (near J102) DEBUG
- (CLK 50Hz)
- (near R111) (IO)
- (RX)
- (TX)
- (IO)
- (interrupt needed on this pin)
- (AN)
- (near L24) 300mA
- If=3mA
- (near J54) par défaut
- (near J54) CC sur routage
- (near R112) JTAG_EN :
  Si =0 (JC1 monté) -> BDM mode
  Si =1 (JC1 non monté) -> JTAG mode
- Routing notes:
  1) careful for EMC is needed
  2) careful for EMC is needed
  High current tracks
- 300mA
- 2) découplage alim proche de chaque patte du micro
- (Clock or IO)
- (near C55) (PWM)
- Coeur
- (in symbol Title_new) Sheet Size:; Carte Boîtier Principal; A3; Print Date:; [No Variations]; Page:; /; EDA: ALtium Desingner 16; Rev. D

### Library data of the parts
C25-C28 = C_0603_NPO_5%_18P-50V: Condensateur céramique, NPO, 5%, CMS 0603, 18pF/50V; Creation: FB (04/07/12); Boitier: 0603; Remarque: {Remarque}; Fabricant: Kemet; Ref Fab: C0603C180J5GAC; Coeff: 1; ComponentLink2URL: o:\_Documentation\Datasheets\_BOITIERS\PASSIF_CMS\; Config: *; ComponentLink1Description: Datasheet; ComponentLink2Description: Datasheet Boitier; Supplier 1: Farnell; Supplier Part Number 1: 1414620
C32 C33 C36-C46 C55-C57 = C_0603_X7R_10%_100N-50V: Condensateur céramique, X7R, 10%, CMS 0603, 100nF/50V; Creation: FB (29/02/12); Boitier: 0603; Remarque: {Remarque}; Fabricant: Kemet; Ref Fab: C0603C104K5RAC; Coeff: 1; ComponentLink1URL: O:\_Documentation\Datasheets\Kemet\Condos_Ceramic_CMS.pdf; ComponentLink2URL: o:\_Documentation\Datasheets\_BOITIERS\PASSIF_CMS\; Config: *; ComponentLink1Description: Datasheet; ComponentLink2Description: Datasheet Boitier; Supplier 1: Farnell; Supplier Part Number 1: 1288255
C34 C35 = C_0805_X5R_10%_10U-16V: Condensateur céramique, X5R, 10%, CMS 0805, 10uF/16V; Creation: FB (02/10/12); Boitier: 0805; Remarque: {Remarque}; Coeff: 1; Fabricant: Kemet; Ref Fab: C0805C106K4PAC; Verification: *; ComponentLink1URL: O:\_Documentation\Datasheets\Kemet\Condos_Ceramic_CMS.pdf; ComponentLink2URL: o:\_Documentation\Datasheets\_Boitiers\PASSIF_CMS\RC_0805_(2x1,25)_(Schneider).pdf; Config: *; ComponentLink1Description: Datasheet; ComponentLink2Description: Datasheet Boitier
C102 = C_0603_X7R_10%_10N-50V: Condensateur céramique, X7R, 10%, CMS 0603; Creation: CHD; Boitier: 0603; Remarque: {Remarque}; Coeff: 1; Fabricant: Kemet; Ref Fab: C0603C103K5RAC; ComponentLink1URL: o:\_Documentation\Datasheets\Kemet\Condos_Ceramic_CMS.pdf; ComponentLink2URL: o:\_Documentation\Datasheets\_BOITIERS\PASSIF_CMS\; Config: *; ComponentLink1Description: Datasheet; ComponentLink2Description: Datasheet Boitier; Supplier 1: Farnell; Supplier Part Number 1: 1414609
C120 = C_0805_X5R_10%_1U-25V: Condensateur céramique, X5R, 10%, CMS 0805; Creation: FB (07/03/12); Reference: 001834/00; Boitier: 0805; Remarque: {Remarque}; Coeff: 1; Fabricant: AVX; Ref Fab: 08053D105KAT2A; Verification: *; ComponentLink1URL: O:\_Documentation\Datasheets\AVX\Condensateurs_CMS_Ceramic_X5R.pdf; ComponentLink2URL: o:\_Documentation\Datasheets\_Boitiers\PASSIF_CMS\RC_0805_(2x1,25)_(Schneider).pdf; Config: *; ComponentLink1Description: Datasheet; ComponentLink2Description: Datasheet Boitier; Supplier Part Number 1: 1327695; Supplier Part Number 2: 6983409; Supplier 1: Farnell; Supplier 2: Radiospares
DL7 = LED_0805_VERT_KP2012: LED CMS 0805, Vert, Vf 2.5V@20mA (4-15mCd), 525nm, vue 120°; Creation: LJ (12/01/09); Reference: 000037/00; Boitier: 0805; Remarque: {Remarque}; Coeff: 1; Fabricant: Kingbright; Ref Fab: KP-2012SGC; Verification: *; ComponentLink1URL: o:\_Documentation\Datasheets\Kingbright\Leds_0805_Green_KP-2012SGC.pdf; ComponentLink2URL: o:\_Documentation\Datasheets\Kingbright\Leds_0805_Green_KP-2012SGC.pdf; Config: *; ComponentLink1Description: Datasheet; ComponentLink2Description: Datasheet Boitier; Supplier 1: Farnell; Supplier Part Number 1: 1318243
J33 = BARRETTE_2.54_M_D_2X05_L6_G: Barrette, e2.54, mâle, 2x5 picots 0.635², droit, long. contact 6, isol. 2.6mm, doré; Creation: LJ; Reference: 000221/05; Boitier: 2x5_e2.54_drt_L6mm; Remarque: Longueur contact idéale pour accueillir HE10; Verification: LJ (13/11/03); Coeff: 1; Fabricant: Samtec; Ref Fab: TSW-105-24-L-D; ComponentLink1URL: o:\_Documentation\Datasheets\Samtec\TSW_TH.PDF; Config: *; ComponentLink1Description: Datasheet; ComponentLink2Description: Datasheet Boitier; Supplier 1: Farnell; Supplier Part Number 1: 2029785
J54 = CAVALIER_EMBASE_2PTS_E2.54: Barrette, e2.54, mâle, 1x2 picots 0.635², droit, long. contact 6, isol. 2.6mm, doré; Creation: LJ; Reference: 000048/02; Boitier: 1x02_e2.54_drt_L6mm; Remarque: Longueur contact idéale pour accueillir HE10; Verification: LJ (13/11/03); Coeff: 1; Fabricant: Samtec; Ref Fab: TSW-102-24-L-S; Value: e2.54-D-L6; ComponentLink1URL: o:\_Documentation\Datasheets\Samtec\TSW_TH.PDF; Config: *; ComponentLink1Description: Datasheet; ComponentLink2Description: Datasheet Boitier
J102 = BARRETTE_2.54_M_D_1X04_L6_G: Barrette, e2.54, mâle, 1x4 picots 0.635², droit, long. contact 6, isol. 2.6mm, doré; Creation: LJ; Reference: 000048/04; Boitier: 1x04_e2.54_drt_L6mm; Remarque: Longueur contact idéale pour accueillir HE10; Verification: LJ (13/11/03); Coeff: 1; Fabricant: Samtec; Ref Fab: TSW-104-24-L-S; ComponentLink1URL: o:\_Documentation\Datasheets\Samtec\TSW_TH.PDF; Config: *; ComponentLink1Description: Datasheet; ComponentLink2Description: Datasheet Boitier; Supplier 1: Farnell; Supplier Part Number 1: 2039591
JT1-JT42 JT52 JT53 JT66 JT78 JT79 = POINT_TEST_PAD_40MIL: Point de test sur CI, pad de diamètre 1.016mm (40mils); Creation: FB (04/10/12); Remarque: {Remarque}; Coeff: 1; Value: POINT_TEST; Config: *; ComponentLink1Description: Datasheet; ComponentLink2Description: Datasheet Boitier
L24 L25 = IND_FERRITE_0603_742792643: Inductance à ferrite multicouches CMS, imp=700R@250MHz, +/-25%, Rdc=350mR, I=400mA; Creation: PDP (02/08/12); Boitier: 0603; Coeff: 1; Fabricant: Wurth Elektronik; ComponentLink1URL: o:\_Documentation\Datasheets\Murata\Ferrite_BLM21P.pdf; Config: *; ComponentLink1Description: Datasheet; ComponentLink2Description: Datasheet Boitier; Ref Fab: 742792643; Supplier 1: Farnell; Supplier Part Number 1: 1800349
Q1 = QUARTZ_HC49/4HSMX_25M: Quartz CMS série HCM49 (équiv HC49/US), -10/+60°C, +/-30ppm, 18pF; Creation: LJ (11/03/09); Reference: 000495/00; Fabricant: Citizen; Ref Fab: HCM49 25.000MABJ-UT; Coeff: 1; Verification: *; Boitier: HC49/4HSMX; Remarque: *; ComponentLink1URL: O:\_Documentation\Datasheets\Citizen\Quartz_HC49-US_HCM49.pdf; ComponentLink2URL: o:\_Documentation\Datasheets\_BOITIERS\; Config: *; ComponentLink1Description: Datasheet; ComponentLink2Description: Datasheet Boitier; Supplier 1: Farnell; Supplier 2: Mouser; Supplier Part Number 1: 1457105; Supplier Part Number 2: 695-HCM49-25-U
Q2 = QUARTZ_2X6MM_CMS_32.768KHZ: Quartz CMS type Montre (cylindrique 2x6mm), -40/+85°C, +/-20ppm, 7pF, 32.768KHz; Creation: LJ (17/02/11); Reference: 001582/00; Boitier: QuartzCyl_2x6mm_CMS; Fabricant: Citizen; Ref Fab: CMR200T32.768KDZY-UT; Coeff: 1; Verification: *; Remarque: *; ComponentLink1URL: o:\_Documentation\Datasheets\Citizen\Quartz_CMR200-32,768kHz_CMS.pdf; ComponentLink2URL: o:\_Documentation\Datasheets\_BOITIERS\; Config: *; ComponentLink1Description: Datasheet; ComponentLink2Description: Datasheet Boitier; Supplier 1: Farnell; Supplier 2: Mouser; Supplier Part Number 1: 1703589; Supplier Part Number 2: 695-CMR200T32.7KY-U
R47 R112 = RES_0603_1%_100PPM_22R: Résistance, 0.100W, 1%, 100ppm, 75V, 22R; Creation: FB (05/07/12); Boitier: 0603; Remarque: {Remarque}; Fabricant: Vishay; Ref Fab: CRCW060322R0FKEA; Coeff: 1; Verification: *; ComponentLink1URL: O:\_Documentation\Datasheets\Vishay\Resistances_D-CRCWe3.pdf; ComponentLink2URL: o:\_Documentation\Datasheets\_BOITIERS\PASSIF_CMS\; Config: *; ComponentLink1Description: Datasheet; ComponentLink2Description: Datasheet Boitier; Supplier 1: Farnell; Supplier Part Number 1: 1469781
R48 = RES_0603_1%_100PPM_1M: Résistance, 0.100W, 1%, 100ppm, 75V, 1M; Creation: FB (04/07/12); Boitier: 0603; Remarque: {Remarque}; Fabricant: Vishay; Ref Fab: CRCW06031M00FKEA; Coeff: 1; Verification: *; ComponentLink1URL: O:\_Documentation\Datasheets\Vishay\Resistances_D-CRCWe3.pdf; ComponentLink2URL: o:\_Documentation\Datasheets\_BOITIERS\PASSIF_CMS\; Config: *; ComponentLink1Description: Datasheet; ComponentLink2Description: Datasheet Boitier; Supplier 1: Farnell; Supplier Part Number 1: 1469746
R82 R83 R96 R98 R99 R103-R107 R113 R141 R188 = RES_0603_1%_100PPM_10K: Résistance, 0.100W, 1%, 100ppm, 75V, 10K; Creation: JPL (05/07/12); Boitier: 0603; Remarque: {Remarque}; Fabricant: Vishay; Ref Fab: CRCW060310K0FKEA; Coeff: 1; Verification: *; ComponentLink1URL: O:\_Documentation\Datasheets\Vishay\Resistances_D-CRCWe3.pdf; ComponentLink2URL: o:\_Documentation\Datasheets\_BOITIERS\PASSIF_CMS\; Config: *; ComponentLink1Description: Datasheet; ComponentLink2Description: Datasheet Boitier; Supplier 1: Farnell; Supplier 2: RadioSpares; Supplier Part Number 1: 1469748; Supplier Part Number 2: 6789667
R108 = RES_0603_1%_100PPM_680R: Résistance, 0.100W, 1%, 100ppm, 75V, 680R; Creation: FB (02/08/12); Boitier: 0603; Remarque: {Remarque}; Fabricant: Vishay; Ref Fab: CRCW0603680RFKEA; Coeff: 1; Verification: *; ComponentLink1URL: O:\_Documentation\Datasheets\Vishay\Resistances_D-CRCWe3.pdf; ComponentLink2URL: o:\_Documentation\Datasheets\_BOITIERS\PASSIF_CMS\; Config: *; ComponentLink1Description: Datasheet; ComponentLink2Description: Datasheet Boitier; Supplier 1: Farnell; Supplier Part Number 1: 1469834; Supplier 2: Mouser; Supplier Part Number 2: 71-CRCW0603-680-E3
R109 R110 = RES_0603_1%_100PPM_68R: Résistance, 0.100W, 1%, 100ppm, 75V, 68R; Creation: FB (01/03/12); Boitier: 0603; Remarque: {Remarque}; Fabricant: Vishay; Ref Fab: CRCW060368R0FKEA; Coeff: 1; Verification: *; ComponentLink1URL: O:\_Documentation\Datasheets\Vishay\Resistances_D-CRCWe3.pdf; ComponentLink2URL: o:\_Documentation\Datasheets\_BOITIERS\PASSIF_CMS\; Config: *; ComponentLink1Description: Datasheet; ComponentLink2Description: Datasheet Boitier; Supplier 1: Farnell; Supplier 2: RadioSpares; Supplier Part Number 1: 1469833; Supplier Part Number 2: 6790645
R111 = RES_0805_5%_300PPM_18M: Résistance, 0.125W, 5%, 300ppm, 150V, 18M; Creation: FB (03/07/12); Boitier: 0805; Remarque: {Remarque}; Coeff: 1; Fabricant: Yageo; Ref Fab: RC0805JR-0718ML; Verification: *; ComponentLink2URL: o:\_Documentation\Datasheets\_BOITIERS\PASSIF_CMS\RC_0805_(2x1,25)_(Schneider).PDF; Config: *; ComponentLink1Description: Datasheet; ComponentLink2Description: Datasheet Boitier; Supplier Part Number 1: 9236422; Supplier 1: Farnell
RR1 = RES_4XR0603_IND_5%_22R*: Réseau de 4 résistances 0603 individuels, 63mW, 5%, CONCAVE / CONVEXE, CMS 1206; Creation: CHD; Reference: 001805/00; Boitier: ARx241; Remarque: {Remarque}; Verification: LJ (07/02/12); Coeff: 1; Fabricant: Yageo; Ref Fab: YC164-JR-0722RL; ComponentLink1URL: o:\_Documentation\Datasheets\Phycomp\ARC-ARV241-242.PDF; ComponentLink2URL: o:\_Documentation\Datasheets\_BOITIERS\; Config: *; ComponentLink1Description: Datasheet; ComponentLink2Description: Datasheet Boitier; Supplier 1: Farnell; Supplier Part Number 1: 9234411
T65 = BC847C: Transistor NPN, Vce=50V, Ic=0.1A, hfe=420~800, 0.25W, CMS; Creation: GO (08/07/05); Verification: LJ (21/07/05); Reference: 000329/00; Boitier: SOT23_3L; Remarque: Complementaires aux BC856-860; Fabricant: NXP; Coeff: 1; Ref Fab: BC847C; ComponentLink1URL: O:\_Documentation\Datasheets\NXP\BC847.pdf; ComponentLink2URL: o:\_Documentation\Datasheets\_BOITIERS\ACTIF_CMS\SOT\SOT_23_3P_(Schneider).PDF; Config: *; ComponentLink1Description: Datasheet; Value: BC847C; Supplier 1: Farnell; Supplier Part Number 1: 1081235; ComponentLink2Description: Datasheet Boitier
Title_new#5 = Title_new
U10 = MCF52259CAG80: Microcontrôleur 32bit, COLDFIRE, 80Mhz, 512Ko Flash, 64Ko RAM, CMS; Creation: FB (05/07/12); Boitier: LQFP144_e0.50_20x20mm; Remarque: {Remarque}; Coeff: 1; Fabricant: Freescale; Ref Fab: MCF52259CAG80; ComponentLink1Description: Datasheet; ComponentLink1URL: o:\_Documentation\Datasheets\; ComponentLink2Description: Datasheet Boitier; ComponentLink2URL: o:\_Documentation\Datasheets\_BOITIERS\; Supplier 1: Farnell; Supplier Part Number 1: 1698075; Value: MCF52259CAG80